# EAGLE board DragonBoard (EAGLE 6.6.0)
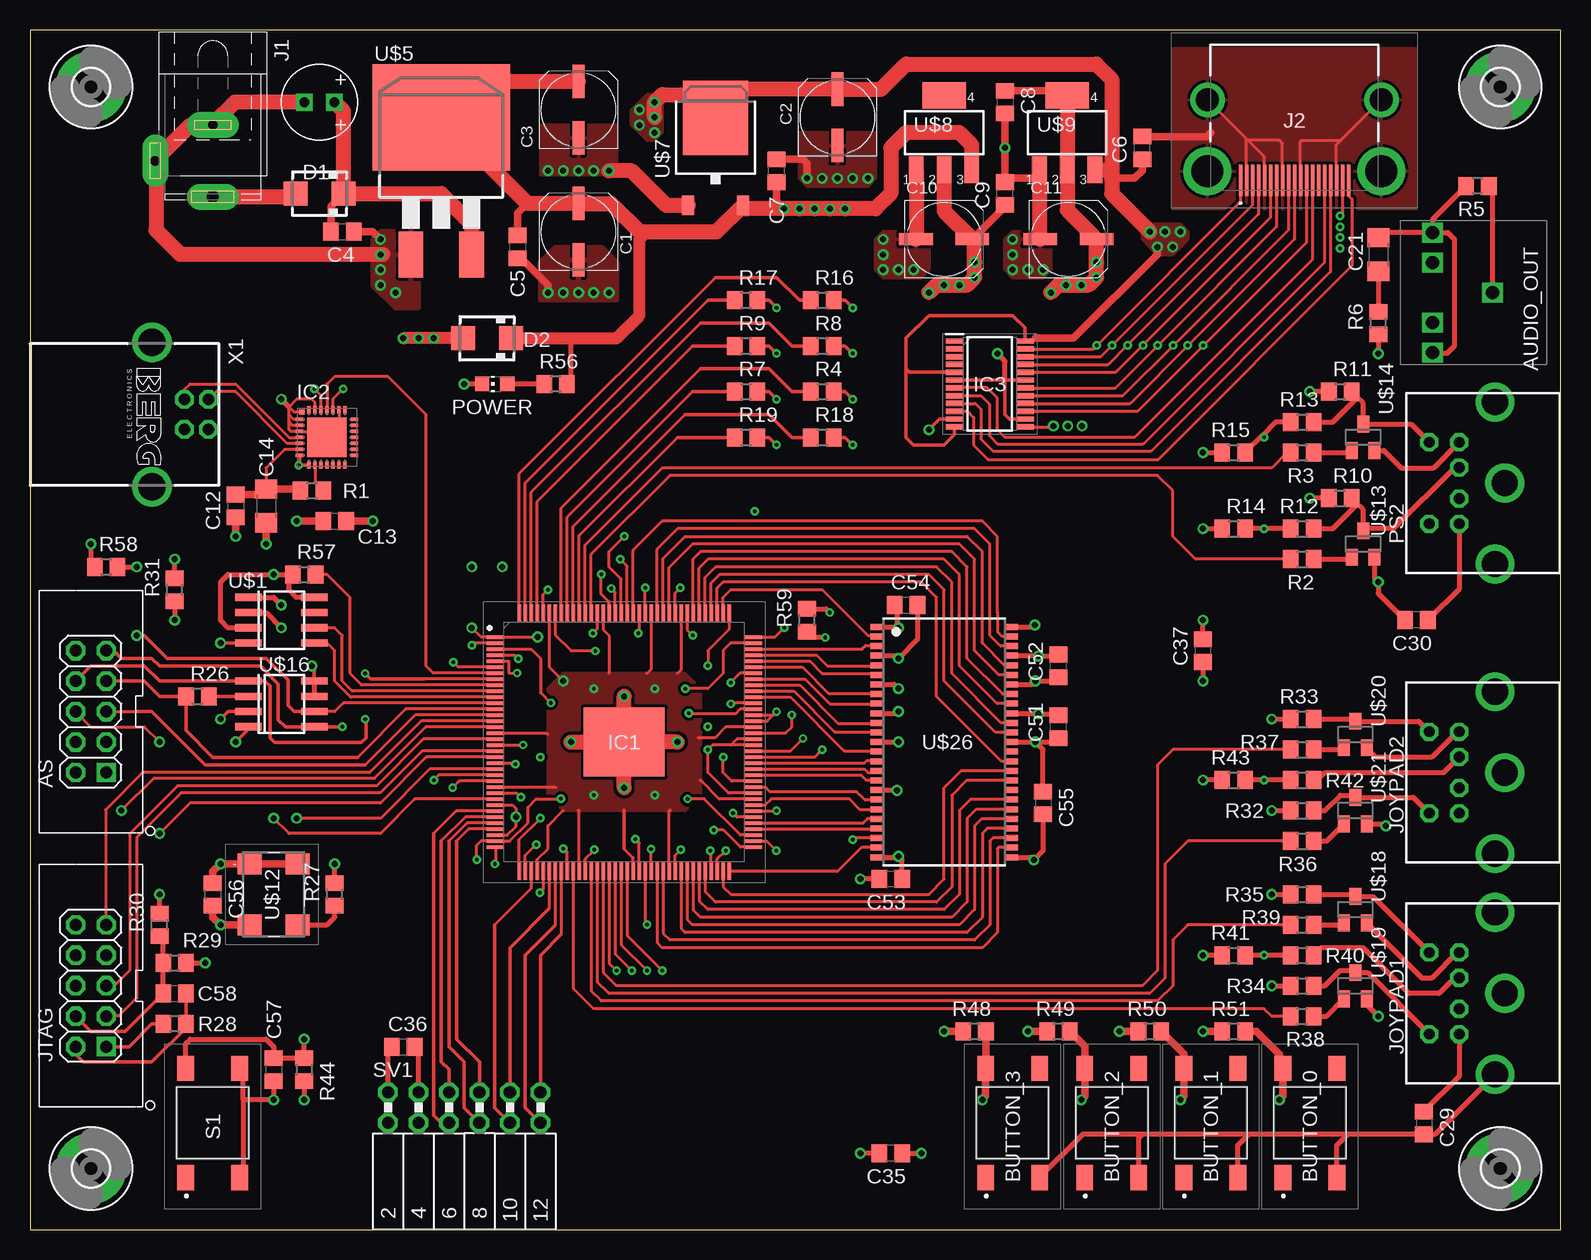
[diagram p2: board, top side]
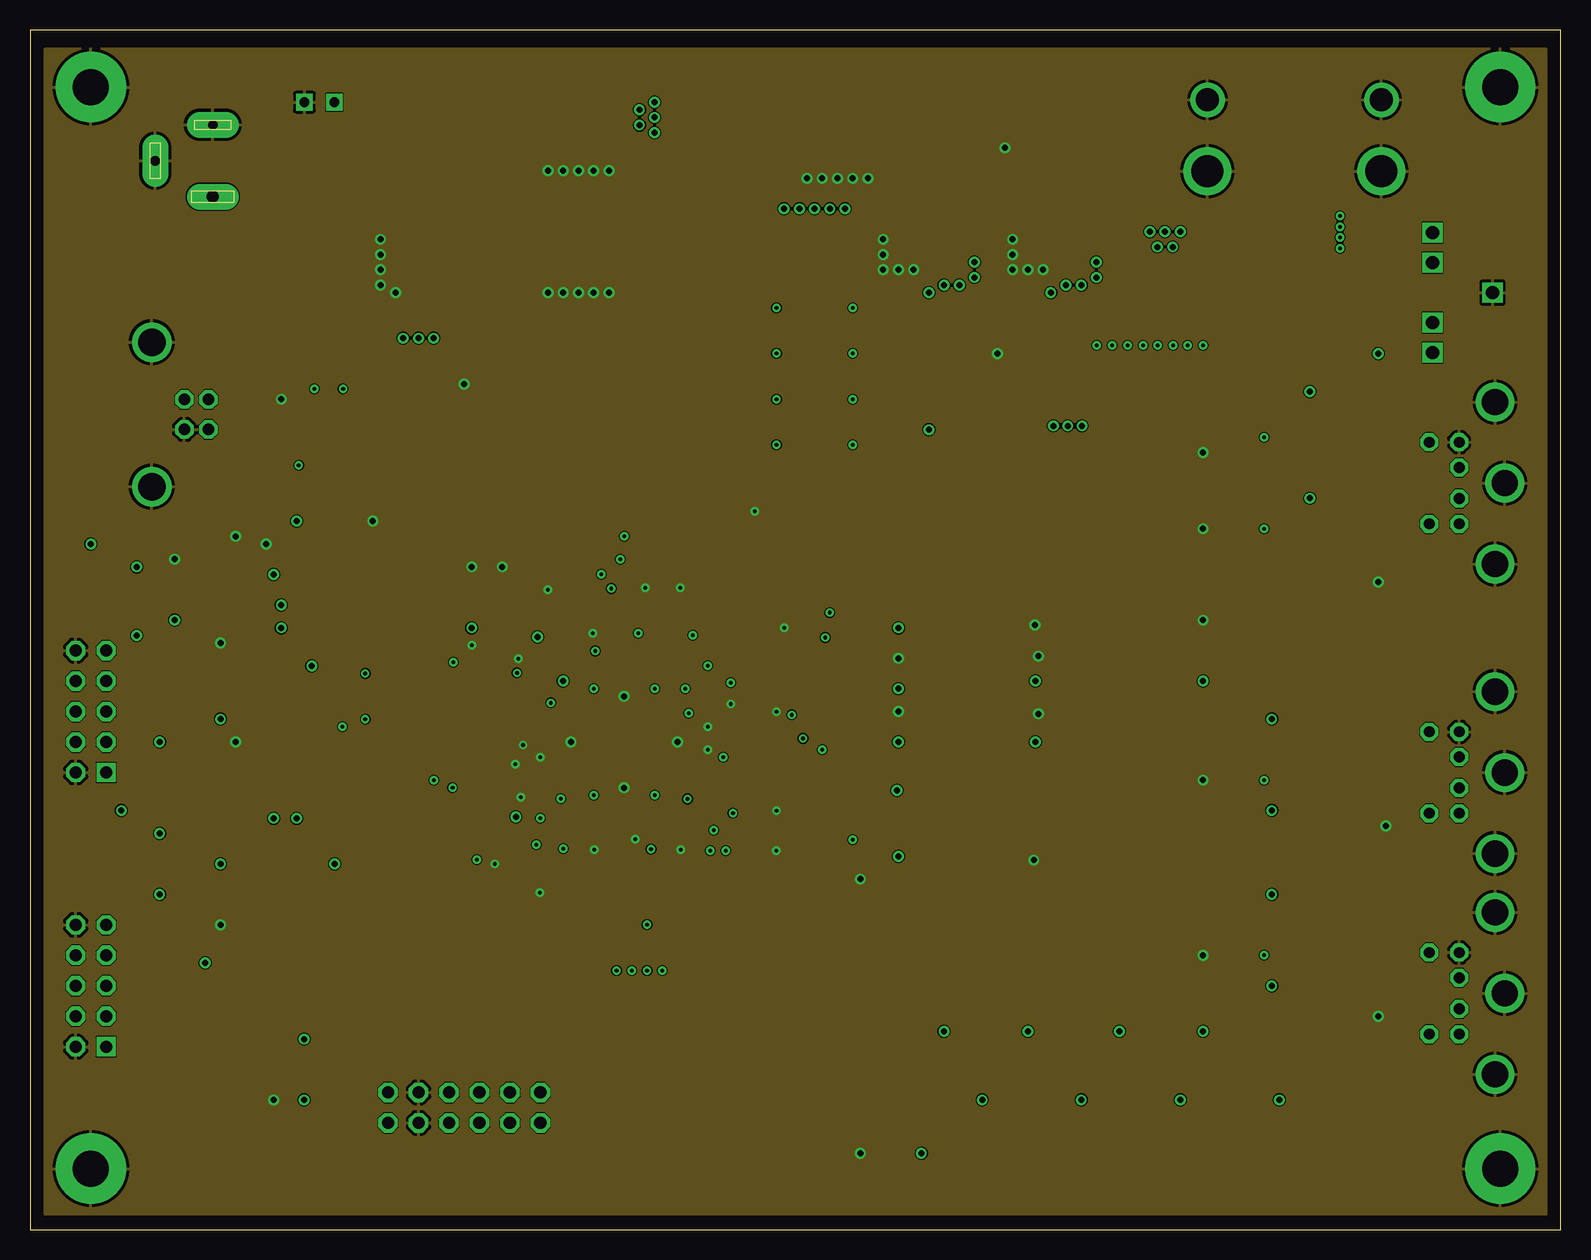
[diagram p3: board, inner layer Inner2]
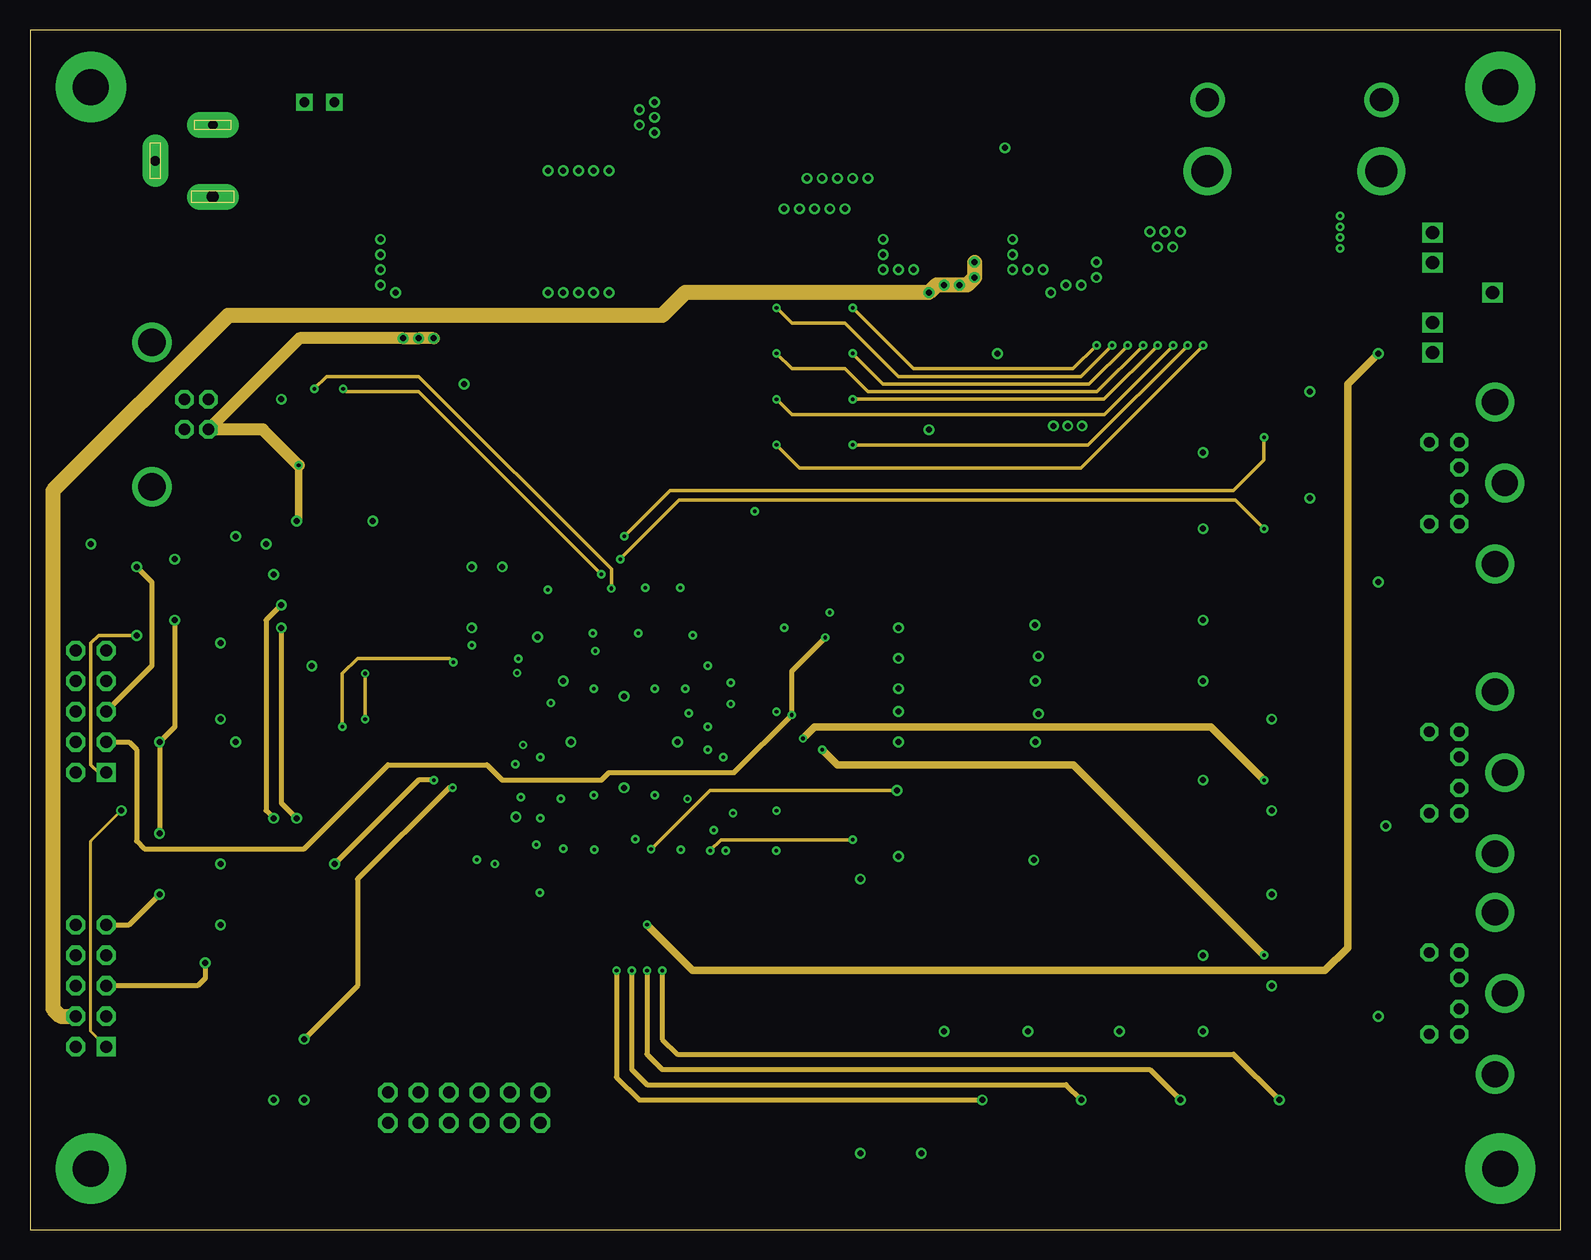
[diagram p4: board, inner layer Inner15]
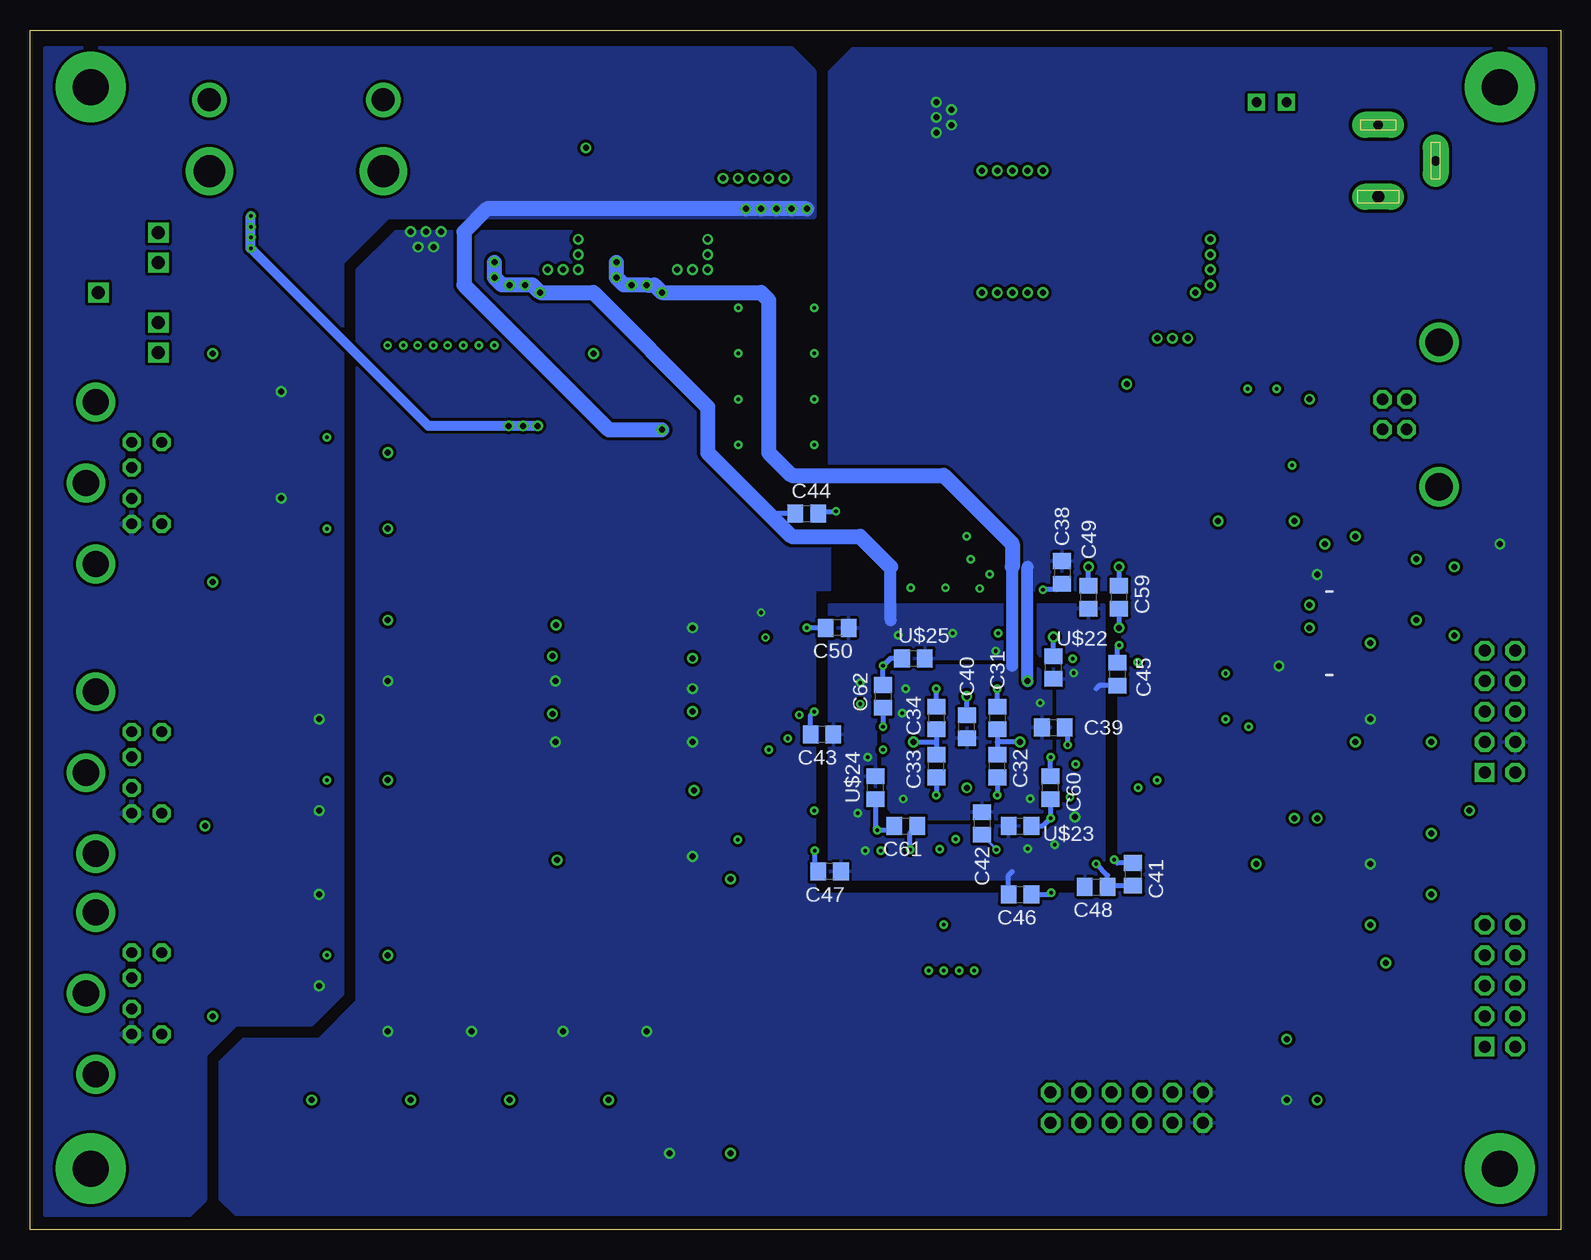
[diagram p5: board, bottom side, seen from below]

Size 127.61 x 100 mm. Coordinates in mm from the lower left corner, seen from the top.
Outline: 0,0 127.61,0 127.61,100 0,100 0,0
Copper layers (1*2+15*16): Top 0.035mm / dielectric 1.5mm / Inner2 0.035mm / dielectric 0.15mm / Inner15 0.035mm / dielectric 0.2mm / Bottom 0.035mm
Design rules "JLC_4_layer": minimum track width 0.09mm, minimum drill 0.2mm, track to track 0.09mm, track to pad 0.2mm, pad to pad 5mil, via to via 0.5mm, smd to smd 5mil, copper to edge 40mil, drill to drill 1mil, minimum pad ring 0.3mm, minimum via ring 0.2mm, stop-mask expansion 4mil, vias tented up to drill 0mil, thermal gap 10mil

## Footprints (pad centres in the part's own frame; a part is rotated, then mirrored left to right if it is on the bottom)
2X05 = drill 1.016 square: 1 -5.08,-1.27 | drill 1.016 octagon: 2 -5.08,1.27; 3 -2.54,-1.27; 4 -2.54,1.27; 5 0,-1.27; 6 0,1.27; 7 2.54,-1.27; 8 2.54,1.27; 9 5.08,-1.27; 10 5.08,1.27
3.5_AUDIO = drill 1.1 square: RING 5,-5; RING_SWITCH 2.5,-5; SLEEVE 0,0; TIP -5,-5; TIP_SWITCH -2.5,-5
LL3301NF065QG = smd 2.1 x 1.4: 1 -4.55,2.25; 2 4.55,2.25; 3 -4.55,-2.25; 4 4.55,-2.25
UD-6,3X5,8_NICHICON = smd 2.8 x 1: + 2.35,0; - -2.35,0
C0805 = smd 1.3 x 1.5: 1 -0.95,0; 2 0.95,0
C1206 = smd 1.6 x 1.8: 1 -1.4,0; 2 1.4,0
SMA = smd 2 x 2: A 2,0; C -2,0
3,0-PAD = drill 3 pad 5.842: B3,0 0,0
QFP50P2200X2200X165-145N = smd 1.475 x 0.3: 1 -10.738,8.75; 2 -10.738,8.25; 3 -10.738,7.75; 4 -10.738,7.25; 5 -10.738,6.75; 6 -10.738,6.25; 7 -10.738,5.75; 8 -10.738,5.25; 9 -10.738,4.75; 10 -10.738,4.25; 11 -10.738,3.75; 12 -10.738,3.25; 13 -10.738,2.75; 14 -10.738,2.25; 15 -10.738,1.75; 16 -10.738,1.25; 17 -10.738,0.75; 18 -10.738,0.25; 19 -10.738,-0.25; 20 -10.738,-0.75; 21 -10.738,-1.25; 22 -10.738,-1.75; 23 -10.738,-2.25; 24 -10.738,-2.75; 25 -10.738,-3.25; 26 -10.738,-3.75; 27 -10.738,-4.25; 28 -10.738,-4.75; 29 -10.738,-5.25; 30 -10.738,-5.75; 31 -10.738,-6.25; 32 -10.738,-6.75; 33 -10.738,-7.25; 34 -10.738,-7.75; 35 -10.738,-8.25; 36 -10.738,-8.75; 73 10.738,-8.75; 74 10.738,-8.25; 75 10.738,-7.75; 76 10.738,-7.25; 77 10.738,-6.75; 78 10.738,-6.25; 79 10.738,-5.75; 80 10.738,-5.25; 81 10.738,-4.75; 82 10.738,-4.25; 83 10.738,-3.75; 84 10.738,-3.25; 85 10.738,-2.75; 86 10.738,-2.25; 87 10.738,-1.75; 88 10.738,-1.25; 89 10.738,-0.75; 90 10.738,-0.25; 91 10.738,0.25; 92 10.738,0.75; 93 10.738,1.25; 94 10.738,1.75; 95 10.738,2.25; 96 10.738,2.75; 97 10.738,3.25; 98 10.738,3.75; 99 10.738,4.25; 100 10.738,4.75; 101 10.738,5.25; 102 10.738,5.75; 103 10.738,6.25; 104 10.738,6.75; 105 10.738,7.25; 106 10.738,7.75; 107 10.738,8.25; 108 10.738,8.75 | smd 0.3 x 1.475: 37 -8.75,-10.738; 38 -8.25,-10.738; 39 -7.75,-10.738; 40 -7.25,-10.738; 41 -6.75,-10.738; 42 -6.25,-10.738; 43 -5.75,-10.738; 44 -5.25,-10.738; 45 -4.75,-10.738; 46 -4.25,-10.738; 47 -3.75,-10.738; 48 -3.25,-10.738; 49 -2.75,-10.738; 50 -2.25,-10.738; 51 -1.75,-10.738; 52 -1.25,-10.738; 53 -0.75,-10.738; 54 -0.25,-10.738; 55 0.25,-10.738; 56 0.75,-10.738; 57 1.25,-10.738; 58 1.75,-10.738; 59 2.25,-10.738; 60 2.75,-10.738; 61 3.25,-10.738; 62 3.75,-10.738; 63 4.25,-10.738; 64 4.75,-10.738; 65 5.25,-10.738; 66 5.75,-10.738; 67 6.25,-10.738; 68 6.75,-10.738; 69 7.25,-10.738; 70 7.75,-10.738; 71 8.25,-10.738; 72 8.75,-10.738; 109 8.75,10.738; 110 8.25,10.738; 111 7.75,10.738; 112 7.25,10.738; 113 6.75,10.738; 114 6.25,10.738; 115 5.75,10.738; 116 5.25,10.738; 117 4.75,10.738; 118 4.25,10.738; 119 3.75,10.738; 120 3.25,10.738; 121 2.75,10.738; 122 2.25,10.738; 123 1.75,10.738; 124 1.25,10.738; 125 0.75,10.738; 126 0.25,10.738; 127 -0.25,10.738; 128 -0.75,10.738; 129 -1.25,10.738; 130 -1.75,10.738; 131 -2.25,10.738; 132 -2.75,10.738; 133 -3.25,10.738; 134 -3.75,10.738; 135 -4.25,10.738; 136 -4.75,10.738; 137 -5.25,10.738; 138 -5.75,10.738; 139 -6.25,10.738; 140 -6.75,10.738; 141 -7.25,10.738; 142 -7.75,10.738; 143 -8.25,10.738; 144 -8.75,10.738 | smd 6.76 x 5.765: 145 0,0
MLP28 = smd 0.6 x 0.3: 1 -2.3,1.5; 2 -2.3,1; 3 -2.3,0.5; 4 -2.3,0; 5 -2.3,-0.5; 6 -2.3,-1; 7 -2.3,-1.5; 15 2.3,-1.5; 16 2.3,-1; 17 2.3,-0.5; 18 2.3,0; 19 2.3,0.5; 20 2.3,1; 21 2.3,1.5 | smd 0.3 x 0.6: 8 -1.5,-2.3; 9 -1,-2.3; 10 -0.5,-2.3; 11 0,-2.3; 12 0.5,-2.3; 13 1,-2.3; 14 1.5,-2.3; 22 1.5,2.3; 23 1,2.3; 24 0.5,2.3; 25 0,2.3; 26 -0.5,2.3; 27 -1,2.3; 28 -1.5,2.3 | smd 3.3 x 3.3: EXP 0,0 | smd 0.435 x 0.435: M -2.103,2.103
SOP65P640X120-24N = smd 1.475 x 0.45: 1 -2.938,3.575; 2 -2.938,2.925; 3 -2.938,2.275; 4 -2.938,1.625; 5 -2.938,0.975; 6 -2.938,0.325; 7 -2.938,-0.325; 8 -2.938,-0.975; 9 -2.938,-1.625; 10 -2.938,-2.275; 11 -2.938,-2.925; 12 -2.938,-3.575; 13 2.938,-3.575; 14 2.938,-2.925; 15 2.938,-2.275; 16 2.938,-1.625; 17 2.938,-0.975; 18 2.938,-0.325; 19 2.938,0.325; 20 2.938,0.975; 21 2.938,1.625; 22 2.938,2.275; 23 2.938,2.925; 24 2.938,3.575
SPC4078 = drill 0.8 pad 2.184 long: 1 -3,0; 2 0,-4.8 | drill 1 pad 2.184 long: 3 3,0
RAHHD19TR = smd 0.28 x 2.6: 1 4.5,5.25; 2 4,5.25; 3 3.5,5.25; 4 3,5.25; 5 2.5,5.25; 6 2,5.25; 7 1.5,5.25; 8 1,5.25; 9 0.5,5.25; 10 0,5.25; 11 -0.5,5.25; 12 -1,5.25; 13 -1.5,5.25; 14 -2,5.25; 15 -2.5,5.25; 16 -3,5.25; 17 -3.5,5.25; 18 -4,5.25; 19 -4.5,5.25 | drill 2.66 pad 3.99: MH1 7.25,4.49; MH2 -7.25,4.49 | drill 1.92 pad 2.88: MH3 7.25,-1.47; MH4 -7.25,-1.47
MDIN06SS = drill 0.9 octagon: 1 1.3,8.5; 2 -1.3,8.5; 3 3.4,8.5; 4 -3.4,8.5; 5 3.4,11; 6 -3.4,11 | drill 2.2 pad 2.6: S1 -6.75,5.5; S2 0,4.7; S3 6.75,5.5
CHIP-LED0805 = smd 1.2 x 1.2: A 0,-1.05; C 0,1.05
R0805 = smd 1.3 x 1.5: 1 -0.95,0; 2 0.95,0
FE06-2W = drill 1.016 octagon: 1 -6.35,1.27; 2 -6.35,-1.27; 3 -3.81,1.27; 4 -3.81,-1.27; 5 -1.27,1.27; 6 -1.27,-1.27; 7 1.27,1.27; 8 1.27,-1.27; 9 3.81,1.27; 10 3.81,-1.27; 11 6.35,1.27; 12 6.35,-1.27
SO08 = smd 0.6 x 2.2: 1 -1.905,-2.75; 2 -0.635,-2.75; 3 0.635,-2.75; 4 1.905,-2.75; 5 1.905,2.75; 6 0.635,2.75; 7 -0.635,2.75; 8 -1.905,2.75
D2PACK = smd 2.083 x 3.81: 1 -2.54,-8.89; 3 2.54,-8.89 | smd 11.43 x 8.89: 2 0,2.54
NXA_35V100_6.3X11 = drill 0.8 square: P$1 -1.25,0; P$2 1.25,0
TO252 = smd 1 x 1.6: 1 -2.28,-4.8; 3 2.28,-4.8 | smd 5.4 x 6.2: 2 0,2.5
SOT223 = smd 1.219 x 2.235: 1 -2.311,-3.099; 2 0,-3.099; 3 2.311,-3.099 | smd 3.6 x 2.2: 4 0,3.099
ASV32000MHZET = smd 1.78 x 2: 1 -2.54,-2; 2 2.54,-2; 3 2.54,2; 4 -2.54,2
SOT23 = smd 1 x 1.4: 1 -0.95,-1.1; 2 0.95,-1.1; 3 0,1.1
TSOP50-II = smd 0.5 x 1.1: 1 -9.6,-5.6; 2 -8.8,-5.6; 3 -8,-5.6; 4 -7.2,-5.6; 5 -6.4,-5.6; 6 -5.6,-5.6; 7 -4.8,-5.6; 8 -4,-5.6; 9 -3.2,-5.6; 10 -2.4,-5.6; 11 -1.6,-5.6; 12 -0.8,-5.6; 13 0,-5.6; 14 0.8,-5.6; 15 1.6,-5.6; 16 2.4,-5.6; 17 3.2,-5.6; 18 4,-5.6; 19 4.8,-5.6; 20 5.6,-5.6; 21 6.4,-5.6; 22 7.2,-5.6; 23 8,-5.6; 24 8.8,-5.6; 25 9.6,-5.6; 26 9.6,5.6; 27 8.8,5.6; 28 8,5.6; 29 7.2,5.6; 30 6.4,5.6; 31 5.6,5.6; 32 4.8,5.6; 33 4,5.6; 34 3.2,5.6; 35 2.4,5.6; 36 1.6,5.6; 37 0.8,5.6; 38 0,5.6; 39 -0.8,5.6; 40 -1.6,5.6; 41 -2.4,5.6; 42 -3.2,5.6; 43 -4,5.6; 44 -4.8,5.6; 45 -5.6,5.6; 46 -6.4,5.6; 47 -7.2,5.6; 48 -8,5.6; 49 -8.8,5.6; 50 -9.6,5.6
PN61729-S = drill 0.95 octagon: 1 1.25,4.71; 2 -1.25,4.71; 3 -1.25,2.71; 4 1.25,2.71 | drill 2.3 pad 2.9: S1 -6.02,0; S2 6.02,0

## Placement (x,y rotation side)
AS  [2X05]  5.08,43.18 90 top
AUDIO_OUT  3.5_AUDIO  [3.5_AUDIO]  121.92,78.11 270 top
BUTTON_0  LL3301NF065QG  [LL3301NF065QG]  106.68,8.89 90 top
BUTTON_1  LL3301NF065QG  [LL3301NF065QG]  98.42,8.89 90 top
BUTTON_2  LL3301NF065QG  [LL3301NF065QG]  90.17,8.89 90 top
BUTTON_3  LL3301NF065QG  [LL3301NF065QG]  81.92,8.89 90 top
C1  100u  [UD-6,3X5,8_NICHICON]  45.72,83.19 90 top
C2  100u  [UD-6,3X5,8_NICHICON]  67.31,92.71 90 top
C3  100u  [UD-6,3X5,8_NICHICON]  45.72,93.34 90 top
C4  104  [C0805]  26.04,83.19 0 top
C5  104  [C0805]  40.64,81.92 270 top
C6  104  [C0805]  92.71,90.17 90 top
C7  104  [C0805]  62.23,88.27 90 top
C8  104  [C0805]  81.28,93.98 270 top
C9  104  [C0805]  81.28,86.36 90 top
C10  100u  [UD-6,3X5,8_NICHICON]  76.2,82.55 0 top
C11  100u  [UD-6,3X5,8_NICHICON]  86.56,82.55 0 top
C12  104  [C0805]  17.14,60.33 270 top
C13  104  [C0805]  25.4,59.05 0 top
C14  106  [C1206]  19.68,60.33 270 top
C21  106  [C1206]  112.39,81.28 270 top
C29  104  [C0805]  116.2,8.89 270 top
C30  104  [C0805]  115.57,50.8 180 top
C31  104  [C0805]  46.99,42.65 270 bottom
C32  104  [C0805]  46.99,38.63 90 bottom
C33  104  [C0805]  52.07,38.63 90 bottom
C34  104  [C0805]  52.07,42.65 270 bottom
C35  104  [C0805]  71.75,6.35 180 top
C36  104  [C0805]  31.11,15.24 0 top
C37  104  [C0805]  97.79,48.26 90 top
C38  104  [C0805]  41.58,54.78 270 bottom
C39  104  [C0805]  42.31,41.87 0 bottom
C40  104  [C0805]  49.53,41.91 90 bottom
C41  104  [C0805]  35.67,29.61 270 bottom
C42  104  [C0805]  48.26,33.85 270 bottom
C43  104  [C0805]  61.59,41.27 180 bottom
C44  104  [C0805]  62.87,59.69 0 bottom
C45  104  [C0805]  36.95,46.29 90 bottom
C46  104  [C0805]  45.09,27.94 0 bottom
C47  104  [C0805]  60.96,29.84 180 bottom
C48  104  [C0805]  38.73,28.57 0 bottom
C49  104  [C0805]  39.37,52.7 90 bottom
C50  104  [C0805]  60.33,50.16 180 bottom
C51  104  [C0805]  85.72,41.91 90 top
C52  104  [C0805]  85.72,46.99 90 top
C53  104  [C0805]  71.75,29.21 180 top
C54  104  [C0805]  73.03,52.07 0 top
C55  104  [C0805]  84.45,35.56 270 top
C56  104  [C0805]  15.24,27.94 270 top
C57  104  [C0805]  20.32,13.34 270 top
C58  104  [C0805]  12.06,19.68 0 top
C59  104  [C0805]  36.83,52.7 90 bottom
C60  104  [C0805]  42.55,36.83 90 bottom
C61  104  [C0805]  54.61,33.66 0 bottom
C62  104  [C0805]  56.52,44.45 270 bottom
D1  MBRA340T3  [SMA]  24.13,86.36 180 top
D2  MBRA340T3  [SMA]  38.1,74.3 180 top
H1  MOUNT-PAD-ROUND3.0  [3,0-PAD]  5.08,95.25 0 top
H2  MOUNT-PAD-ROUND3.0  [3,0-PAD]  122.56,95.25 0 top
H3  MOUNT-PAD-ROUND3.0  [3,0-PAD]  122.56,5.08 0 top
H4  MOUNT-PAD-ROUND3.0  [3,0-PAD]  5.08,5.08 0 top
IC1  EP4CE15E22C8N  [QFP50P2200X2200X165-145N]  49.53,40.64 0 top
IC2  CP2102  [MLP28]  24.77,66.04 0 top
IC3  TPD12S016PWR  [SOP65P640X120-24N]  80.01,70.48 0 top
J1  [SPC4078]  15.24,89.1 270 top
J2  RAHHD19TR  [RAHHD19TR]  105.41,92.71 180 top
JOYPAD1  [MDIN06SS]  127.64,19.68 90 top
JOYPAD2  [MDIN06SS]  127.64,38.1 90 top
JTAG  [2X05]  5.08,20.32 90 top
POWER  LED_0805  [CHIP-LED0805]  38.73,70.48 90 top
PS2  [MDIN06SS]  127.64,62.23 90 top
R1  10k  [R0805]  23.5,61.59 0 top
R2  5k6  [R0805]  106.05,55.88 0 top
R3  5k6  [R0805]  106.05,64.77 0 top
R4  50  [R0805]  66.04,69.85 0 top
R5  5k6  [R0805]  120.65,87 180 top
R6  10k  [R0805]  112.39,75.56 90 top
R7  50  [R0805]  59.69,69.85 0 top
R8  50  [R0805]  66.04,73.66 0 top
R9  50  [R0805]  59.69,73.66 0 top
R10  1k  [R0805]  109.22,60.96 0 top
R11  1k  [R0805]  109.22,69.85 0 top
R12  5k6  [R0805]  106.05,58.42 0 top
R13  5k6  [R0805]  106.05,67.31 0 top
R14  10k  [R0805]  100.33,58.42 0 top
R15  10k  [R0805]  100.33,64.77 0 top
R16  50  [R0805]  66.04,77.47 0 top
R17  50  [R0805]  59.69,77.47 0 top
R18  50  [R0805]  66.04,66.04 0 top
R19  50  [R0805]  59.69,66.04 0 top
R26  33  [R0805]  13.97,44.45 0 top
R27  33  [R0805]  25.4,27.94 90 top
R28  1k  [R0805]  12.06,17.14 180 top
R29  10k  [R0805]  12.06,22.23 0 top
R30  10k  [R0805]  10.79,25.4 90 top
R31  10k  [R0805]  12.06,53.34 90 top
R32  1k  [R0805]  106.05,34.92 0 top
R33  1k  [R0805]  106.05,42.55 0 top
R34  1k  [R0805]  106.05,20.32 0 top
R35  1k  [R0805]  106.05,27.94 0 top
R36  5k6  [R0805]  106.05,32.38 0 top
R37  5k6  [R0805]  106.05,40.01 0 top
R38  5k6  [R0805]  106.05,17.78 0 top
R39  5k6  [R0805]  106.05,25.4 0 top
R40  5k6  [R0805]  106.05,22.86 0 top
R41  10k  [R0805]  100.33,22.86 0 top
R42  5k6  [R0805]  106.05,37.47 0 top
R43  10k  [R0805]  100.33,37.47 0 top
R44  10k  [R0805]  22.86,13.34 270 top
R48  10k  [R0805]  78.74,16.51 180 top
R49  10k  [R0805]  85.72,16.51 180 top
R50  10k  [R0805]  93.34,16.51 180 top
R51  10k  [R0805]  100.33,16.51 180 top
R56  2k2  [R0805]  43.81,70.48 180 top
R57  10k  [R0805]  22.86,54.61 0 top
R58  10k  [R0805]  6.35,55.24 0 top
R59  10k  [R0805]  64.77,50.8 90 top
S1  LL3301NF065QG  [LL3301NF065QG]  15.24,8.89 90 top
SV1  [FE06-2W]  36.2,10.16 0 top
U$1  BY25Q16BS  [SO08]  20.95,50.8 270 top
U$5  LM1086  [D2PACK]  34.29,90.17 0 top
U$6  NXA_35V100_6.3X11  [NXA_35V100_6.3X11]  24.13,93.98 0 top
U$7  LD1117D-3.3  [TO252]  57.15,90.17 0 top
U$8  KIA1117-2.5  [SOT223]  76.2,91.44 0 top
U$9  AZ1117H-1.2TRG1  [SOT223]  86.46,91.44 0 top
U$12  OT705050MJBA4SL  [ASV32000MHZET]  20.32,27.94 270 top
U$13  PMBT3904  [SOT23]  111.12,57.15 0 top
U$14  PMBT3904  [SOT23]  111.12,66.04 0 top
U$16  BY25Q16BS  [SO08]  20.95,43.81 270 top
U$18  PMBT3904  [SOT23]  110.49,26.67 0 top
U$19  PMBT3904  [SOT23]  110.49,20.32 0 top
U$20  PMBT3904  [SOT23]  110.49,41.27 0 top
U$21  PMBT3904  [SOT23]  110.49,34.92 0 top
U$22  CBG201209U601T  [C0805]  42.31,46.85 90 bottom
U$23  CBG201209U601T  [C0805]  45.09,33.66 0 bottom
U$24  CBG201209U601T  [C0805]  57.15,36.83 90 bottom
U$25  CBG201209U601T  [C0805]  53.98,47.62 0 bottom
U$26  W9816G6JH  [TSOP50-II]  76.2,40.64 270 top
X1  PN61729-S  [PN61729-S]  10.16,67.94 270 top

## Tracks (layer width: path | path; a pad name or v marks a point on that pad's centre or on a via)
1V2  (via drill 0.3, 0.5)
  Top 0.254: IC1.124 50.78,49.78 v50.7,49.7 | IC1.5 39.9,47.39 39.9,46.4 v40.6,46.4 | IC1.38 41.28,31.18 v42.2,32.1 | IC1.29 40.21,35.39 40.5,35.1 v40.5,34.4 40.5,33.6 39.79,32.89 IC1.34 | IC1.45 44.78,31.42 | IC1.116 54.78,49.99 v55.24,49.53 | IC1.138 43.78,49.56 45.09,48.26 47.08,48.26 v47.11,48.23 | IC1.70 57.28,30.88 v58,31.6 | IC1.102 59.19,46.39 v58.4,45.6 | IC1.84 58.49,37.39 57.78,38.1 v57.78,39.37 | IC1.78 58.91,34.39 v58.6,34.7
  Top 0.305: 44.78,31.42 v44.45,31.75
  Top 0.61: C8.1 86.07,94.93 U$9.4
  Top 1.27: U$9.4 U$9.2 86.46,85 C11.+ v88.9,80.64 v88.9,79.38 88.27,78.74 v87.63,78.74 v86.36,78.74 85.72,78.74 v85.09,78.11
  Bottom 0.406: C46.1 46.03,29.53 45.72,29.84 | C45.1 38.48,45.34 38.73,45.09 | C44.1 65.41,59.69 65.72,59.37
  Bottom 1.016: 55.88,50.8 55.88,55.24
  Bottom 1.27: v88.9,80.64 v88.9,79.38 88.27,78.74 v87.63,78.74 v86.36,78.74 85.72,78.74 v85.09,78.11 80.64,78.11 71.12,68.58 71.12,64.77 65.72,59.37 64.14,57.78 58.42,57.78 55.88,55.24
  pour Bottom (isolate 0.254): 47.62,52.07 46.35,52.07 46.35,47.62 55.88,47.62 57.15,46.35 57.15,34.92 55.88,33.66 43.18,33.66 41.91,34.92 41.91,46.35 43.18,47.62 43.81,48.26 43.81,52.07 38.1,52.07 38.1,29.21 60.96,29.21 60.96,52.07
2V5  (via drill 0.3, 0.5)
  Top 0.254: IC1.3 41.78,48.39 42.55,47.62 42.55,44.76 v43.4,43.9 | v44.23,35.9 42.2,35.9 41.5,35.2 41.5,33.9 39.99,32.39 IC1.35 37.59,32.39 37.2,32 37.2,30.87 v37.25,30.82 | IC1.107 58.41,48.89 57.78,48.26 57.78,46.35 56.52,45.09 v54.61,45.09 | IC1.96 59.19,43.39 58.8,43 54.95,43 v54.91,43.05 | IC1.75 59.21,32.89 56.2,35.9 v54.81,35.9
  Top 0.305: JTAG.4 5.08,16.51 7.94,16.51 C58.1
  Top 0.406: C58.1 R29.1 11.12,24.13 R30.1
  Top 0.61: C9.1 81.28,85.28 C10.+
  Top 1.27: U$8.2 76.2,84.9 C10.+ 78.74,82.36 v78.74,80.64 v78.74,79.38 78.11,78.74 v77.47,78.74 v76.2,78.74 75.56,78.74 v74.93,78.11
  Inner15 1.27: v78.74,80.64 v78.74,79.38 78.11,78.74 v77.47,78.74 v76.2,78.74 75.56,78.74 v74.93,78.11 54.61,78.11 52.7,76.2 16.51,76.2 1.91,61.59 1.91,18.41 2.54,17.78 JTAG.4
  Bottom 0.406: C41.1 36.99,30.56 v37.25,30.82
  Bottom 1.016: 45.72,46.99 45.72,55.24
  Bottom 1.27: v78.74,80.64 v78.74,79.38 78.11,78.74 v77.47,78.74 v76.2,78.74 75.56,78.74 v74.93,78.11 66.67,78.11 66.04,77.47 66.04,64.77 64.14,62.87 51.44,62.87 45.72,57.15 45.72,55.24
  pour Bottom (isolate 0.254): 42.55,41.91 42.55,35.56 43.81,34.29 55.24,34.29 56.52,35.56 56.52,45.72 55.24,46.99 44.45,46.99 43.81,46.99 42.55,45.72
3V3  (via drill 0.3, 0.5)
  Top 0.254: IC1.17 43.06,41.39 43.18,41.27 | IC1.139 43.28,46.89 v44.45,45.72 | IC1.117 54.28,46.66 53.98,46.35 | IC1.26 43.76,36.89 43.81,36.83 | IC1.40 42.28,30.85 43.18,31.75 43.18,33.66 44.45,34.92 | IC1.47 45.78,34.87 | IC1.62 53.28,34.87 | IC1.56 50.28,31 49.53,31.75 | IC1.122 51.78,46.7 51.44,46.35 | IC1.130 47.78,50.01 48.26,49.53 48.26,46.35 | IC1.81 57.45,35.89 55.88,37.47 | IC1.93 57.99,41.89 57.1,41 55.7,41
  Top 0.305: IC3.12 77.07,66.28 76.2,65.41 73.66,65.41 73.03,66.04 73.03,71.75 | 73.03,71.75 73.03,74.3 74.93,76.2 81.92,76.2 82.95,75.17 IC3.24 83.58,74.06 83.82,74.3 | IC3.5 73.32,71.46 73.03,71.75 | U$16.3 16.51,43.18 v15.88,42.55 | U$16.8 23.7,46.78 v23.5,46.99 | 45.78,34.87 45.72,34.92 | 53.28,34.87 53.34,34.92 | 49.53,31.75 49.53,34.92
  Top 0.406: U$26.1 72.31,50.24 | 72.31,50.24 v72.39,50.16 | U$26.7 72.03,45.44 v72.39,45.09 | U$26.13 v72.39,40.64 | U$26.25 72.31,31.04 v72.39,31.11 72.7,30.8 C53.1 | U$26.44 83.54,45.44 v83.82,45.72 85.41,45.72 C52.1 | U$26.38 v83.82,40.64 | v83.82,40.64 85.41,40.64 C51.1 | 72.31,50.24 72.31,51.83 C54.1 | C55.1 84.45,40.01 v83.82,40.64 | U$16.8 U$16.7 | U$1.3 16.51,50.16 15.88,50.8 15.88,53.98 16.51,54.61 v20.32,54.61 R57.1 21.59,54.29 21.59,53.34 22.23,52.7 U$1.8 | R44.2 v22.86,10.79 | R59.2 66.36,51.75 v66.67,51.44 | v5.08,57.15 5.08,55.56 R58.1 | C35.1 v74.3,6.35 | C37.1 v97.79,45.72 | SV1.1 29.84,14.92 C36.1
  Top 0.61: 83.82,74.3 87,74.3 93.98,81.28 v93.98,81.92 | v76.2,16.51 R48.2 | v83.19,16.51 R49.2 | v90.81,16.51 R50.2 | v97.79,16.51 R51.2 | C6.1 92.71,88.27 92.08,87.63 90.17,87.63 | C56.1 15.24,29.84 v15.88,30.48 U$12.1 U$12.4
  Top 1.27: 90.17,88.27 90.17,95.89 88.9,97.16 73.03,97.16 70.93,95.06 C2.+ 59.54,95.06 U$7.2 55.2,94.61 52.7,94.61 v52.07,93.98 v52.07,92.71 | 90.17,88.27 90.17,87.63 90.17,86.36 v93.34,83.19 | U$9.3 90.09,88.34 90.17,88.27
  Bottom 0.406: C32.1 v46.99,36.2 | C33.1 v52.07,36.2 | C34.1 v52.07,45.09 | C31.1 v46.99,45.09
  Bottom 1.016: v44.45,45.72 44.45,55.24
  other vias: 94.61,83.19 95.89,83.19 95.25,81.92 52.07,91.44 50.8,93.34 50.8,92.08
  pour Top (isolate 0.254): 43.18,36.2 43.18,45.09 44.45,46.35 54.61,46.35 55.88,45.09 55.88,36.2 54.61,34.92 44.45,34.92
  pour Top (isolate 0.254): 94.61,83.82 95.89,83.82 96.52,83.19 96.52,82.55 95.89,81.92 95.25,81.28 93.98,81.28 93.34,81.92 92.71,82.55 92.71,83.19 93.34,83.82
  pour Top (isolate 0.254): 52.7,92.71 52.7,93.98 52.07,94.61 51.44,94.61 50.8,93.98 50.16,93.34 50.16,92.08 50.8,91.44 51.44,90.81 52.07,90.81 52.7,91.44
  pour Bottom (isolate 0.254): 60.96,88.9 60.96,96.52 59.05,98.42 1.27,98.42 1.27,1.27 51.44,1.27 51.44,27.94 36.83,27.94 36.83,53.34 60.96,53.34
  pour Bottom (isolate 0.254): 100.33,80.01 100.33,19.05 103.5,15.88 109.86,15.88 111.76,13.97 111.76,2.54 110.49,1.27 51.44,1.27 51.44,27.94 62.23,27.94 62.23,53.34 60.96,53.34 60.96,83.19 97.16,83.19
5V0  (via drill 0.5)
  Top 0.305: IC3.11 75.81,67.56 v74.93,66.67
  Top 0.406: R11.1 v106.68,69.85 | R10.1 v106.68,60.96 | v103.5,27.94 R35.1 | v103.5,20.32 R34.1 | v103.5,34.92 R32.1 | v103.5,42.55 R33.1 | PS2.4 119.14,53.41 C30.1 | JOYPAD1.4 119.14,12.77 C29.1 | R56.1 45.09,70.48 45.09,74.3
  Top 0.61: C5.1 40.64,84.71 41.47,85.53 | C7.1 62.23,85.72 v62.87,85.09
  Top 1.016: D2.C 45.09,74.3 48.9,74.3 50.8,76.2 50.8,82.55 51.44,83.19
  Top 1.27: C3.+ 37.27,95.69 U$5.2 41.47,85.53 C1.+ 48.45,85.53 50.8,83.19 51.44,83.19 57.24,83.19 U$7.3 59.71,85.09 v62.87,85.09 v64.14,85.09 v65.41,85.09 v66.67,85.09 v67.94,85.09 70.48,85.09 71.75,86.36 71.75,90.17 73.03,91.44 77.47,91.44 78.51,90.4 U$8.3
  Bottom 1.27: v62.87,85.09 v62.88,85.1 64.12,85.1 v64.14,85.09 v65.41,85.09 v66.67,85.09 v67.94,85.09 89.53,85.09 91.44,83.19 91.44,78.74 79.38,66.67 v74.93,66.67
  pour Bottom (isolate 0.254): 62.23,84.45 62.23,96.52 64.14,98.42 126.36,98.42 126.36,1.27 114.3,1.27 113.03,2.54 113.03,14.61 110.49,17.14 104.14,17.14 101.6,19.68 101.6,80.64 97.79,84.45
A0
  Top 0.254: IC1.77 69.45,33.89 69.85,34.29 70.55,34.29 U$26.21
A1
  Top 0.254: IC1.76 70.55,33.39 U$26.22
A2  (via drill 0.3)
  Top 0.254: IC1.69 56.78,31.52 v56.7,31.6 | U$26.23 68.74,32.64 v68.6,32.5
  Inner15 0.305: v68.6,32.5 57.6,32.5 v56.7,31.6
A3
  Top 0.254: U$26.24 69.31,31.84 67.31,29.84 58.34,29.84 IC1.72
A4
  Top 0.254: U$26.27 80.73,31.84 80.64,31.75 80.64,24.77 79.38,23.5 52.7,23.5 52.28,23.92 IC1.60
A5
  Top 0.254: U$26.28 80.27,32.64 80.01,32.38 80.01,25.4 78.74,24.13 53.34,24.13 52.78,24.69 IC1.61
A6
  Top 0.254: U$26.29 79.8,33.44 79.38,33.02 79.38,26.04 78.11,24.77 54.61,24.77 54.28,25.09 IC1.64
A7
  Top 0.254: U$26.30 79.33,34.24 78.74,33.66 78.74,26.67 77.47,25.4 55.24,25.4 54.78,25.86 IC1.65
A8
  Top 0.254: U$26.31 78.86,35.04 78.11,34.29 78.11,27.3 76.83,26.04 55.88,26.04 55.28,26.64 IC1.66
A9
  Top 0.254: U$26.32 78.39,35.84 77.47,34.92 77.47,27.94 76.2,26.67 56.52,26.67 55.78,27.41 IC1.67
A10
  Top 0.254: U$26.20 70.48,34.92 70.47,34.92 70.4,35 69.2,35 68.3,35.9 61.8,35.9 61.29,35.39 IC1.80
ASDO  (via drill 0.3)
  Top 0.254: IC1.6 35.7,46.89 v35.3,47.3
  Top 0.305: v26.04,41.91 U$16.5 21.3,41.9 20.7,42.5 20.7,45.5 19.21,46.99 10.79,46.99 10.16,47.62 7.62,47.62 6.99,48.26 AS.9
  Inner15 0.305: v35.3,47.3 34.97,47.62 27.3,47.62 26.04,46.35 v26.04,41.91
AUDIO  (via drill 0.3, 0.5)
  Top 0.254: IC1.58 51.28,25.55 v51.44,25.4
  Top 0.406: R6.1 v112.39,73.03
  Inner15 0.61: v112.39,73.03 109.86,70.48 109.86,23.5 107.95,21.59 55.24,21.59 v51.44,25.4
BS
  Top 0.254: IC1.83 61.3,36.89 61.69,36.5 68.9,36.5 69.2,36.2 69.22,36.2 69.61,35.8 70.56,35.8 U$26.19
BUTTON_0  (via drill 0.3, 0.5)
  Top 0.254: IC1.55 49.78,24.52 v52.7,21.59
  Top 0.61: R51.1 102.23,16.51 104.14,14.61 104.14,13.73 BUTTON_0.2 104.43,11.09 v104.14,10.79
  Inner15 0.406: v52.7,21.59 52.7,15.88 53.98,14.61 100.33,14.61 v104.14,10.79
BUTTON_1  (via drill 0.3, 0.5)
  Top 0.254: IC1.54 49.28,23.75 v51.44,21.59
  Top 0.61: R50.1 96.17,14.63 BUTTON_1.2 96.17,11.09 v95.89,10.79
  Inner15 0.406: v51.44,21.59 51.44,14.61 52.7,13.34 93.34,13.34 v95.89,10.79
BUTTON_2  (via drill 0.3, 0.5)
  Top 0.254: IC1.53 48.78,22.98 v50.16,21.59
  Top 0.61: R49.1 87.92,15.27 BUTTON_2.2 87.92,11.09 v87.63,10.79
  Inner15 0.406: v50.16,21.59 50.16,13.34 51.44,12.06 86.36,12.06 v87.63,10.79
BUTTON_3  (via drill 0.3, 0.5)
  Top 0.254: IC1.52 48.28,22.2 v48.9,21.59
  Top 0.61: R48.1 79.69,13.46 BUTTON_3.2 79.67,11.09 v79.38,10.79
  Inner15 0.406: v48.9,21.59 48.9,12.7 50.8,10.79 v79.38,10.79
BY_MISO  (via drill 0.5)
  Top 0.254: IC1.23 33.31,38.39 29.21,34.29 v22.23,34.29
  Top 0.406: U$1.2 19.68,51.44 v20.95,50.16
  Inner15 0.406: v20.95,50.16 20.95,35.56 v22.23,34.29
BY_MOSI
  Top 0.254: IC1.11 26.73,44.39 25.4,45.72 25.4,48.26 24.77,48.9 U$1.5
BY_NCS  (via drill 0.5)
  Top 0.254: IC1.28 32.08,35.89 29.21,33.02 21.59,33.02 v20.32,34.29
  Top 0.406: U$1.1 20.32,52.7 v20.95,52.07
  Inner15 0.406: v20.95,52.07 19.68,50.8 19.68,34.92 v20.32,34.29
BY_SCLK
  Top 0.254: IC1.10 26.86,44.89 26.04,45.72 26.04,49.53 25.4,50.16 U$1.6
CEC_B
  Top 0.254: J2.13 106.91,80.88 92.08,66.04 81.28,66.04 80.64,66.67 80.64,69.32 79.77,70.2 77.11,70.2 IC3.7
CKE
  Top 0.254: U$26.34 78.08,37.44 76.83,36.2 76.83,28.57 75.56,27.3 57.15,27.3 56.28,28.18 IC1.68
CONFIG_DONE  (via drill 0.3)
  Top 0.254: IC1.92 62.98,41.39 63.5,41.91 v63.5,42.9
  Top 0.406: v66.3,49.35 65.27,49.35 R59.1
  Inner15 0.406: v66.3,49.35 63.5,46.55 v63.5,42.9 58.7,38.1 48.26,38.1 47.62,37.47 39.37,37.47 38.1,38.73 29.84,38.73 22.86,31.75 9.53,31.75 8.89,32.38 8.89,40.01 8.26,40.64 AS.3
CP2102_RTS  (via drill 0.3)
  Top 0.254: IC1.129 48.28,52.32 47.6,53 47.6,54.59 v47.62,54.61 | IC2.24 25.27,69.27 v26.1,70.1
  Inner15 0.305: v47.62,54.61 32.38,69.85 26.35,69.85 v26.1,70.1
CP2102_RXD
  Top 0.254: IC2.25 24.77,70.48 25.4,71.12 29.84,71.12 33.02,67.94 33.02,46.99 33.62,46.39 IC1.7
CP2102_TXD  (via drill 0.3)
  Top 0.254: IC1.128 48.78,53.12 v48.46,53.44 | IC2.26 24.27,69.53 v23.7,70.1
  Inner15 0.305: v48.46,53.44 48.46,55.05 32.38,71.12 24.72,71.12 v23.7,70.1
DATA
  Top 0.254: IC1.13 31.32,43.39 27.3,39.37
  Top 0.305: AS.7 9.53,45.72 10.79,44.45 R26.1 13.02,41.59 15.24,39.37 27.3,39.37
DCLK  (via drill 0.5)
  Top 0.254: IC1.12 26.11,43.89 25.4,43.18 U$16.6
  Top 0.305: U$16.6 22.02,43.18 21.5,43.7 21.5,45.81 19.68,47.62 11.43,47.62 9.53,49.53 v8.89,49.53
  Inner15 0.305: AS.1 5.71,38.1 5.08,38.73 5.08,48.9 5.71,49.53 v8.89,49.53
DQ0
  Top 0.254: IC1.110 57.78,52.7 58.42,53.34 66.04,53.34 69.85,49.53 70.51,49.53 U$26.2
DQ1
  Top 0.254: IC1.106 69.37,48.39 69.68,48.7 70.54,48.7 U$26.3
DQ2
  Top 0.254: 70.56,47 U$26.5 70.55,46.99 66.47,46.99 65.58,47.89 IC1.105
DQ3
  Top 0.254: 70.56,46.2 U$26.6 70.48,46.35 66.04,46.35 65,47.39 IC1.104
DQ4
  Top 0.254: 70.56,44.6 U$26.8 70.54,44.7 66.57,44.7 64.38,46.89 IC1.103
DQ5
  Top 0.254: 70.54,43.9 U$26.9 70.58,43.81 66.67,43.81 64.6,45.89 IC1.101
DQ6
  Top 0.254: 70.54,42.3 U$26.11 70.56,42.2 67.37,42.2 64.18,45.39 IC1.100
DQ7
  Top 0.254: 70.56,41.4 U$26.12 70.54,41.5 67.07,41.5 63.68,44.89 IC1.99
DQ8
  Top 0.254: U$26.39 80.48,41.44 76.2,45.72 76.2,53.34 74.93,54.61 57.48,54.61 56.78,53.91 IC1.112
DQ9
  Top 0.254: U$26.40 80.95,42.24 76.83,46.35 76.83,53.98 75.56,55.24 57.15,55.24 56.28,54.38 IC1.113
DQ10
  Top 0.254: U$26.42 80.62,43.84 77.47,46.99 77.47,54.61 76.2,55.88 56.52,55.88 55.78,55.15 IC1.114
DQ11
  Top 0.254: U$26.43 81.09,44.64 78.11,47.62 78.11,55.24 76.83,56.52 55.88,56.52 55.28,55.91 IC1.115
DQ12
  Top 0.254: U$26.45 80.76,46.24 78.74,48.26 78.74,55.88 77.47,57.15 55.24,57.15 53.28,55.19 IC1.119
DQ13
  Top 0.254: U$26.46 81.23,47.04 79.38,48.9 79.38,56.52 78.11,57.78 54.61,57.78 52.78,55.95 IC1.120
DQ14
  Top 0.254: U$26.48 80.9,48.64 80.01,49.53 80.01,57.15 78.74,58.42 53.98,58.42 52.28,56.73 IC1.121
DQ15
  Top 0.254: U$26.49 81.03,49.44 80.67,49.8 80.67,51.41 80.64,51.44 80.64,57.78 79.38,59.05 52.7,59.05 50.28,56.63 IC1.125
FPGA_CLK  (via drill 0.3, 0.5)
  Top 0.254: IC1.24 34.08,37.89 v33.66,37.47
  Top 0.406: R27.2 v25.4,30.48
  Inner15 0.406: v33.66,37.47 32.38,37.47 v25.4,30.48
GND  (via drill 0.3, 0.5)
  Top 0.254: J2.2 101.41,90.93 | 101.41,90.93 J2.MH3 | J2.17 108.91,90.43 109.28,90.81 | 109.28,90.81 J2.MH4 | J2.5 102.91,89.43 101.57,90.77 | 101.57,90.77 101.41,90.93 | J2.8 104.41,90.53 104.14,90.81 101.6,90.81 101.57,90.77 | J2.11 105.91,90.67 106.05,90.81 109.28,90.81 | 21.59,67.31 21.59,66.67 21.73,66.54 IC2.3 24.27,66.54 IC2.EXP 25.77,67.04 IC2.23 | 21.59,67.31 21.59,67.94 | 21.59,67.94 21.59,68.58 | 21.59,68.58 22.23,69.22 23.5,69.22 23.77,68.94 IC2.27 | IC2.2 21.86,67.04 21.59,67.31 | IC2.1 22,67.54 21.59,67.94 | IC2.M 22.03,68.14 21.59,68.58 | IC1.140 42.78,52.94 v43.18,53.34 | IC1.2 37.02,48.89 v36.83,48.7 | IC1.4 40.41,47.89 v40.7,47.6 | IC1.36 38.79,30.54 v38.73,30.48 | IC1.41 42.78,28.38 | IC1.48 46.28,30.89 v47.05,31.66 | IC1.63 53.78,31.18 v54.26,31.66 | IC1.57 50.78,32.23 | IC1.118 53.78,53.08 v54.2,53.5 | IC1.123 51.28,53.48 v51.3,53.5 | IC1.131 47.28,50.08 v46.9,49.7 | IC1.97 58.49,43.89 v58.42,43.81 | IC1.108 62.09,49.39 v62.87,50.16 | IC1.95 61.94,42.89 v62.23,43.18 61.44,42.39 IC1.94 | IC1.27 40.57,36.39 v40.93,36.03 | IC1.19 v41.09,40.39 v41.1,40.4 | IC1.22 40.35,38.89 v40.45,38.8 | IC1.74 61.41,32.39 v62.2,31.6 | IC1.82 58.23,36.39 56.52,38.1 v56.52,40.01 56.9,40.39 58.42,40.39 | IC1.79 62.2,34.89 v62.23,34.92 | IC1.90 58.42,40.39 | IC1.91 58.92,40.89 58.42,40.39
  Top 0.305: IC3.14 81.67,67.56 81.28,67.94 81.28,70.81 | IC3.6 81.28,70.81 | 81.28,70.81 IC3.19 | U$16.4 18.2,41.7 v17.14,40.64 | U$1.4 v15.88,48.9 | 42.78,28.38 v42.5,28.1 | 50.78,32.23 v50.47,32.55 | JTAG.2 3.81,14.61 4.45,13.97 10.16,13.97 13.02,16.82 R28.1 C58.2
  Top 0.406: U$26.41 84.03,43.04 v84.07,43 85.58,43 C51.2 | U$26.47 84.03,47.84 v84.07,47.8 85.58,47.8 C52.2 | U$26.26 83.43,31.04 v83.67,30.8 84.45,31.59 C55.2 | 81.28,70.81 81.28,72.39 v80.64,73.03 | U$14.2 112.86,64.94 114.3,63.5 117,63.5 PS2.3 | v97.79,58.42 R14.1 | v97.79,64.77 R15.1 | U$26.50 83.61,50.24 v83.77,50.4 | U$26.4 72.17,47.84 v72.39,47.62 73.97,49.21 C54.2 | U$26.10 72.25,43.04 v72.39,43.18 | C53.2 v69.22,29.21 | AUDIO_OUT.SLEEVE 121.92,86.67 R5.1 | JOYPAD2.3 118.97,41.5 116.84,39.37 112.25,39.37 U$20.2 | JOYPAD1.3 118.97,23.09 116.84,20.95 116.06,20.95 U$18.2 | R43.1 v97.79,37.47 | R41.1 v97.79,22.86 | U$21.2 112.86,33.83 v113.03,33.66 | U$19.2 111.44,18.73 v112.39,17.78 | U$13.2 112.08,54.3 v112.39,53.98 112.39,53.02 C30.2 | JOYPAD1.S1 117.14,7.94 C29.2 109.86,7.94 | 109.86,7.94 101.6,7.94 | 101.6,7.94 92.71,7.94 | 92.71,7.94 87.77,7.94 BUTTON_3.3 | BUTTON_2.3 92.42,7.65 92.71,7.94 | BUTTON_1.3 100.67,7.01 101.6,7.94 | BUTTON_0.3 108.93,7.01 109.86,7.94 | v20.95,69.22 21.59,68.58 | POWER.C v36.2,70.48 | R31.2 v12.06,55.88 | C57.2 v20.32,10.79 17.78,10.79 | 17.78,10.79 17.78,13.15 S1.4 | 17.78,10.79 17.78,4.63 S1.3 | C35.2 v69.22,6.35 | C37.2 v97.79,50.8 | SV1.3 32.38,14.92 C36.2 | J1.2 10.44,89.14 10.5,89.2
  Top 0.61: C4.2 28.57,83.19 v29.21,82.55 | C5.2 40.95,80.97 43.18,78.74 v43.18,78.11 | C7.2 64.45,89.22 64.77,88.9 v64.77,87.63 | C8.2 v81.28,90.17 81.28,87.63 | 81.28,87.63 C9.2 | 81.28,87.63 83.82,87.63 | C6.2 98.11,91.12 98.42,91.44 | C12.2 v17.14,57.78 | C14.2 v19.68,57.15 | C13.2 v28.57,59.05 | C56.2 15.24,26.04 v15.88,25.4 U$12.2
  Top 1.27: U$7.1 53.06,85.37 50.16,88.27 v48.26,88.27 | U$8.1 73.89,82.59 C10.- | 10.5,89.1 10.5,83.3 12.5,81.3 29.4,81.3 | 22.9,94 17.1,94 15.2,92.1 13.4,92.1 10.5,89.2 10.4,89.1 | U$9.1 84.15,82.61 C11.- | v45.09,40.64 IC1.145 | IC1.145 v49.53,44.45 | v53.98,40.64 IC1.145 | v49.53,36.83 IC1.145
  Bottom 0.254: v47.05,31.66 47.05,31.7 C42.2
  Bottom 0.406: v36.83,55.24 C59.2 | C62.2 v56.52,41.91 | C60.2 v42.55,39.37 | C31.2 46.99,40.64 | 46.99,40.64 C32.2 | v45.09,40.64 46.99,40.64 | C34.2 52.07,40.64 | 52.07,40.64 C33.2 | v53.98,40.64 52.07,40.64 | C50.2 v62.87,50.16 | C49.2 v39.37,55.24 | v38.73,30.48 37.78,29.53 C48.2 37.7,28.66 C41.2 | v54.26,31.66 54.26,33.06 C61.2 | v62.2,31.6 62.2,30.14 C47.2 | C40.2 v49.53,44.45 | v41.1,40.4 41.1,41.6 C39.2 | C46.2 42.66,27.94 v42.5,28.1 | C45.2 36.95,48.57 v36.83,48.7 | C38.2 42.07,53.34 v43.18,53.34 | C44.2 61.74,59.86 v60.42,59.86 | C43.2 62.55,42.87 v62.23,43.18
  other vias: 43.18,88.27 44.45,88.27 45.72,88.27 46.99,88.27 66.04,87.63 67.31,87.63 68.58,87.63 69.85,87.63 84.45,80.01 81.92,82.55 81.92,81.28 81.92,80.01 83.19,80.01 71.12,82.55 71.12,81.28 71.12,80.01 72.39,80.01 73.66,80.01 29.21,81.28 29.21,80.01 29.21,78.74 30.48,78.11 44.45,78.11 45.72,78.11 46.99,78.11 48.26,78.11
  pour Inner2: 1.27,98.42 126.36,98.42 126.36,1.27 1.27,1.27
  pour Top (isolate 0.254): 95.25,98.42 95.25,85.09 115.57,85.09 115.57,98.42
  pour Top (isolate 0.254): 42.55,87.93 42.55,92.08 48.9,92.08 48.9,87.93
  pour Top (isolate 0.254): 64.14,87.63 64.14,91.44 70.48,91.44 70.48,87.63 69.85,87 64.77,87
  pour Top (isolate 0.254): 71.12,83.19 74.3,83.19 74.93,82.55 74.93,80.01 74.3,79.38 71.12,79.38 70.48,80.01 70.48,82.55
  pour Top (isolate 0.254): 42.55,78.11 42.55,80.64 43.18,81.28 43.81,81.92 47.62,81.92 48.9,80.64 48.9,77.47 42.55,77.47
  pour Top (isolate 0.254): 29.21,83.19 28.57,82.55 28.57,78.74 30.48,76.83 32.38,76.83 32.38,83.19
  pour Top (isolate 0.254): 84.45,79.38 81.92,79.38 81.28,80.01 81.28,82.55 81.92,83.19 84.45,83.19 85.09,82.55 85.09,80.01
HDMI_5V  (via drill 0.3, 0.5)
  Top 0.254: J2.18 109.41,84.71 v109.2,84.5 | IC3.13 85.21,66.91 v85.3,67
  Bottom 0.813: v85.3,67 v86.5,67 v87.7,67 94.4,67 v109.2,81.8 | 109.22,81.78 v109.2,81.8 | v109.2,81.8 v109.2,82.7 v109.2,83.6 v109.2,84.5
HDMI_BN
  Top 0.254: 55.24,69.85 44.78,59.38 IC1.136
  Top 0.305: R7.1 55.24,69.85
HDMI_BP
  Top 0.254: 55.88,71.75 44.28,60.16 IC1.137
  Top 0.305: R4.1 63.5,69.85 61.59,71.75 55.88,71.75
HDMI_CLKN  (via drill 0.3)
  Top 0.254: J2.12 106.41,82.28 97.81,73.69 | 97.81,73.69 92.34,68.21 IC3.15 | v97.8,73.7 97.81,73.69
  Top 0.305: R19.2 61.59,66.04 v62.23,65.41
  Inner15 0.305: v62.23,65.41 64.14,63.5 87.6,63.5 v97.8,73.7
HDMI_CLKP  (via drill 0.3)
  Top 0.254: J2.10 105.41,82.55 96.53,73.67 | 96.53,73.67 91.72,68.86 IC3.16 | v96.5,73.7 96.53,73.67
  Top 0.305: R18.2 67.94,66.04 v68.58,65.41
  Inner15 0.305: v68.58,65.41 88.2,65.41 v96.5,73.7
HDMI_CN
  Top 0.254: IC1.134 45.78,57.84 53.98,66.04
  Top 0.305: 53.98,66.04 R19.1
HDMI_CP
  Top 0.254: 54.61,67.94 45.28,58.62 IC1.135
  Top 0.305: R18.1 63.5,66.04 61.59,67.94 54.61,67.94
HDMI_D0N  (via drill 0.3)
  Top 0.254: J2.9 104.91,83.32 v95.3,73.7 | v95.3,73.7 91.1,69.51 IC3.17 | v95.3,73.7
  Top 0.305: R7.2 61.59,69.85 v62.23,69.22
  Inner15 0.305: v62.23,69.22 63.5,67.94 89.55,67.94 v95.3,73.7
HDMI_D0P  (via drill 0.3)
  Top 0.254: J2.7 103.91,83.59 v94.01,73.69 | v94.01,73.69 90.48,70.16 IC3.18 | v94,73.7 v94.01,73.69
  Top 0.305: R4.2 67.94,69.85 v68.58,69.22
  Inner15 0.305: v68.58,69.22 89.52,69.22 v94,73.7
HDMI_D1N  (via drill 0.3)
  Top 0.254: J2.6 103.41,84.36 92.78,73.72 | 92.78,73.72 90.51,71.46 IC3.20 | v92.8,73.7 92.78,73.72
  Top 0.305: R9.2 61.59,73.66 v62.23,73.03
  Inner15 0.305: v62.23,73.03 63.5,71.75 67.94,71.75 69.85,69.85 88.95,69.85 v92.8,73.7
HDMI_D1P  (via drill 0.3)
  Top 0.254: J2.4 102.41,84.63 v91.49,73.71 | v91.49,73.71 89.89,72.11 IC3.21 | v91.5,73.7 v91.49,73.71
  Top 0.305: R8.2 67.94,73.66 v68.58,73.03
  Inner15 0.305: v68.58,73.03 71.12,70.48 88.28,70.48 v91.5,73.7
HDMI_D2N  (via drill 0.3)
  Top 0.254: IC3.22 89.26,72.76 v90.2,73.7 101.91,85.41 J2.3
  Top 0.305: R17.2 61.59,77.47 v62.23,76.83
  Inner15 0.305: v62.23,76.83 63.5,75.56 67.94,75.56 72.39,71.12 87.62,71.12 v90.2,73.7
HDMI_D2P  (via drill 0.3)
  Top 0.254: J2.1 100.91,85.67 88.92,73.68 | 88.92,73.68 88.65,73.41 IC3.23 | v88.9,73.7 88.92,73.68
  Top 0.305: R16.2 67.94,77.47 v68.58,76.83
  Inner15 0.305: v68.58,76.83 73.66,71.75 86.95,71.75 v88.9,73.7
HDMI_GN
  Top 0.254: 55.24,73.66 42.28,60.7 IC1.141
  Top 0.305: R9.1 55.24,73.66
HDMI_GP
  Top 0.254: 55.88,75.56 41.78,61.47 IC1.142
  Top 0.305: R8.1 63.5,73.66 61.59,75.56 55.88,75.56
HDMI_RN
  Top 0.254: IC1.143 41.28,62.23 56.52,77.47
  Top 0.305: 56.52,77.47 R17.1
HDMI_RP
  Top 0.254: 57.15,79.38 40.78,63.01 IC1.144
  Top 0.305: R16.1 64.14,77.47 62.23,79.38 57.15,79.38
HPD_B
  Top 0.254: IC3.10 78.16,68.21 78.67,67.7 78.67,65.4 79.86,64.2 94.05,64.2 110.2,80.36 110.2,85.9 109.91,86.19 J2.19
JP1_CLK
  Top 0.406: R35.2 110.32,27.94 U$18.3 111.95,27.77 JOYPAD1.5
JP1_CLK_Q
  Top 0.254: R39.1 96.52,25.4 95.25,24.13 95.25,20.32 93.98,19.05 47.62,19.05 46.78,19.89 IC1.49
JP1_DATA
  Top 0.406: JOYPAD1.1 118.78,20.98 117.47,19.68 114.94,19.68 111.12,23.5 107.63,23.5 R40.2
JP1_DATA_D  (via drill 0.3)
  Top 0.254: IC1.88 65.42,39.39 v66.04,40.01
  Top 0.406: R40.1 v102.87,22.86 R41.2
  Inner15 0.61: v66.04,40.01 67.31,38.73 87,38.73 v102.87,22.86
JP1_LATCH
  Top 0.406: JOYPAD1.6 111.5,21.42 U$19.3 110.32,21.59 109.22,21.59 107.95,20.32 R34.2
JP1_LATCH_Q
  Top 0.254: R38.1 103.5,17.78 102.87,18.41 46.99,18.41 45.28,20.12 IC1.46
JP2_CLK
  Top 0.406: JOYPAD2.5 115.76,42.38 U$20.3 110.32,42.55 R33.2
JP2_CLK_Q
  Top 0.254: R37.1 95.25,40.01 93.98,38.73 93.98,21.59 92.71,20.32 48.9,20.32 47.78,21.43 IC1.51
JP2_DATA
  Top 0.406: R42.2 107.31,37.47 107.95,38.1 117.83,38.1 JOYPAD2.1
JP2_DATA_D  (via drill 0.3)
  Top 0.254: IC1.89 63.38,39.89 v64.44,40.94
  Top 0.406: R42.1 v102.87,37.47 R43.2
  Inner15 0.61: v64.44,40.94 65.41,41.91 98.42,41.91 v102.87,37.47
JP2_LATCH
  Top 0.406: R32.2 107.95,34.92 109.22,36.2 110.32,36.2 U$21.3 115.31,36.02 JOYPAD2.6
JP2_LATCH_Q
  Top 0.254: R36.1 96.52,32.38 94.61,30.48 94.61,20.95 93.34,19.68 48.26,19.68 47.28,20.66 IC1.50
LDQM
  Top 0.254: 70.56,39.8 U$26.14 70.54,39.9 67.87,39.9 63.38,44.39 IC1.98
N$4
  Top 0.254: IC2.9 23.77,62.27 R1.2
N$7
  Top 0.254: IC2.6 21.23,65.04 19.68,63.5 C14.1 | 22.41,61.73 R1.1
  Top 0.61: C12.1 19.23,61.27 C14.1 22.41,61.73
N$8
  Top 0.406: R2.2 110,55.88 U$13.1
N$9
  Top 0.406: R3.2 110,64.77 U$14.1
N$14
  Top 0.406: AUDIO_OUT.TIP 116.92,84.22 R5.2 | AUDIO_OUT.TIP 112.82,83.11 C21.1 | AUDIO_OUT.TIP 118.19,83.11 118.75,82.55 118.75,73.66 118.11,73.03 117,73.03 AUDIO_OUT.RING
N$17
  Top 0.406: C21.2 R6.2
N$29  (via drill 0.3)
  Top 0.254: IC1.37 40.78,32.52 v42.55,34.29
  Bottom 0.406: U$23.2 43.18,33.66 v42.55,34.29 C60.1
N$31  (via drill 0.5)
  Top 0.254: v36.83,50.16 37.6,49.39 IC1.1 42.1,49.39 v42.31,49.4
  Bottom 0.406: C59.1 v36.83,50.16 | U$22.2 v42.31,49.4
N$36  (via drill 0.3)
  Top 0.254: IC1.109 58.28,50.02 56.52,48.26 v56.52,46.99
  Bottom 0.406: U$25.1 55.88,47.62 v56.52,46.99 C62.1
N$37
  Top 0.305: U$16.2 R26.2
N$38
  Top 0.406: U$12.3 24.77,25.4 25.4,26.04 R27.1
N$42
  Top 0.406: R39.2 109.37,25.4 U$18.1
N$43
  Top 0.406: R38.2 108.1,17.78 U$19.1
N$44
  Top 0.406: R37.2 109.37,40.01 U$20.1
N$45
  Top 0.406: R36.2 108.1,32.38 U$21.1
N$46
  Top 0.406: R56.2 POWER.A
N$47  (via drill 0.3)
  Top 0.254: IC1.73 59.21,31.89 57.8,33.3 v57,33.3
  Bottom 0.406: C61.1 55.91,33.3 v57,33.3 57.15,33.45 U$24.1
N$93
  Top 0.254: IC1.9 27.64,45.39 26.67,46.35 26.67,52.7 24.77,54.61 R57.2
PMOD_0
  Top 0.254: IC1.44 44.28,24.59
  Top 0.305: SV1.11 42.55,22.86 44.28,24.59
PMOD_1
  Top 0.254: IC1.42 43.28,26.77
  Top 0.305: SV1.9 40.01,23.5 43.28,26.77
PMOD_2
  Top 0.254: IC1.33 36.56,33.39 35.56,32.38
  Top 0.305: SV1.7 37.47,13.97 35.56,15.88 35.56,32.38
PMOD_3
  Top 0.254: IC1.31 36.3,34.39 34.29,32.38
  Top 0.305: SV1.5 34.92,13.34 34.29,13.97 34.29,32.38
PMOD_4
  Top 0.254: IC1.43 43.78,25.36
  Top 0.305: SV1.12 41.27,10.16 41.27,22.86 43.78,25.36
PMOD_5
  Top 0.254: 38.73,25.4 41.78,28.45 IC1.39
  Top 0.305: SV1.10 38.73,10.16 38.73,25.4
PMOD_6
  Top 0.254: IC1.32 36.43,33.89 34.92,32.38
  Top 0.305: SV1.8 36.2,10.16 36.2,13.97 34.92,15.24 34.92,32.38
PMOD_7
  Top 0.254: IC1.30 35.52,34.89 33.66,33.02
  Top 0.305: SV1.6 34.29,8.89 33.66,9.53 33.66,33.02
PS2_CLK
  Top 0.406: 110.65,69.37 111.12,68.89 U$14.3 115.12,67.14 PS2.5 | 110.65,69.37 R11.2 | R13.2 108.58,67.31 110.65,69.37
PS2_CLK_D  (via drill 0.3)
  Top 0.254: v102.87,66.04 102.71,66.2 | IC1.127 49.28,54.23 48.26,55.24 48.26,56.52 v49.53,57.78
  Top 0.406: R13.1 103.82,67.31 102.71,66.2 R15.2
  Inner15 0.305: v102.87,66.04 102.87,64.14 100.33,61.59 53.34,61.59 v49.53,57.78
PS2_CLK_Q
  Top 0.254: R3.1 104.78,64.77 103.5,63.5 52.7,63.5 46.28,57.08 IC1.133
PS2_DATA
  Top 0.406: 110.65,60.48 111.12,60.01 U$13.3 111.3,58.42 113.67,58.42 118.78,63.53 PS2.1 | 110.65,60.48 R10.2 | R12.2 108.58,58.42 110.65,60.48
PS2_DATA_D  (via drill 0.3)
  Top 0.254: IC1.126 49.78,55.3 v49.2,55.88
  Top 0.406: R12.1 v102.87,58.42 R14.2
  Inner15 0.305: v102.87,58.42 100.49,60.8 54.12,60.8 v49.2,55.88
PS2_DATA_Q
  Top 0.254: R2.1 97.16,55.88 95.25,57.78 95.25,61.59 93.98,62.87 53.34,62.87 46.78,56.3 IC1.132
RESET  (via drill 0.3, 0.5)
  Top 0.254: IC1.25 35.78,37.39 v35.23,36.83
  Top 0.406: S1.2 12.99,15.53 13.34,15.88 19.68,15.88 20.32,15.24 C57.1 R44.1 v22.86,15.88
  Inner15 0.406: v35.23,36.83 34.92,36.83 27.3,29.21 27.3,20.32 v22.86,15.88
RW
  Top 0.254: 70.56,39 U$26.15 70.54,39.1 69.77,39.1 69.56,38.89 IC1.87
SCL_B
  Top 0.254: J2.15 107.91,80.61 92.81,65.5 80.67,65.5 79.97,66.2 79.97,68.8 79.25,69.51 IC3.8
SDA_B
  Top 0.254: J2.16 108.41,79.83 93.47,64.9 80.27,64.9 79.27,65.9 79.27,68.4 78.81,68.86 IC3.9
SDRAM_CLK
  Top 0.254: U$26.35 77.61,38.24 76.2,36.83 76.2,29.21 74.93,27.94 58.42,27.94 57.78,28.58 IC1.71
TCK  (via drill 0.5)
  Top 0.254: v7.62,34.92 10.29,37.6 28.7,37.6 32.99,41.89 IC1.16
  Top 0.305: JTAG.1 8.26,15.24 10.16,17.14 R28.2
  Inner15 0.254: JTAG.1 5.08,16.51 5.08,32.38 v7.62,34.92
TDI  (via drill 0.5)
  Top 0.254: JTAG.9 6.3,25.45 6.3,35 9.4,38.1 28.3,38.1 32.59,42.39 IC1.15
  Top 0.406: R30.2 v10.79,27.94
  Inner15 0.406: JTAG.9 8.26,25.4 v10.79,27.94
TDO
  Top 0.254: IC1.20 32.69,39.89 29.2,36.4 12.6,36.4 8.9,32.7 8.9,19.3 7.4,17.8 6.37,17.8 JTAG.3
TMS  (via drill 0.5)
  Top 0.254: IC1.18 32.79,40.89 28.9,37 12.3,37 8.3,33 8.3,21.6 7,20.3 6.37,20.3 JTAG.5
  Top 0.406: R29.2 v14.61,22.23
  Inner15 0.406: v14.61,22.23 14.61,20.95 13.97,20.32 JTAG.5
UDQM
  Top 0.254: U$26.36 80.97,39.04 75.56,44.45 75.56,52.7 74.3,53.98 57.78,53.98 57.28,53.47 IC1.111
USB_DN
  Top 0.254: IC2.5 21.45,65.54 17.14,69.85 15.53,69.85 X1.2
USB_DP
  Top 0.254: X1.3 12.87,70.02 13.34,70.48 17.14,70.48 21.59,66.04 IC2.4
VBUS  (via drill 0.3, 0.5)
  Top 0.254: IC2.7 22.46,63.77 v22.4,63.7 22.44,63.74 IC2.8
  Top 0.61: C13.1 v22.23,59.05
  Top 1.016: D2.A v31.11,74.3
  Inner15 0.61: v22.4,63.7 22.4,59.23 v22.23,59.05
  Inner15 1.016: v22.4,63.7 19.41,66.69 X1.1 22.47,74.3 v31.11,74.3 v32.38,74.3 v33.66,74.3
VHIGH
  Top 0.61: C4.1 25.09,85.31 D1.C
  Top 1.27: U$6.P$2 26.13,93.23 D1.C 34.29,86.36 36.83,83.82 U$5.3
VIN
  Top 1.27: J1.3 21.87,86.1 D1.A
~CAS
  Top 0.254: 70.56,38.2 U$26.16 70.46,38.1 69.85,38.1 69.56,38.39 IC1.86
~CE  (via drill 0.5)
  Top 0.254: AS.6 5.08,41.91 9.53,41.91 v10.79,40.64 | IC1.21 33.04,39.39 29.21,35.56 13.34,35.56 v10.79,33.02
  Top 0.406: R31.1 v12.06,50.8
  Inner15 0.406: v10.79,33.02 v10.79,40.64 12.06,41.91 v12.06,50.8
~CONFIG  (via drill 0.5)
  Top 0.254: AS.5 8.89,43.18 | IC1.14 32.09,42.89 27.94,38.73
  Top 0.305: 27.94,38.73 14.61,38.73 10.16,43.18 8.89,43.18
  Top 0.406: R58.2 v8.89,55.24
  Inner15 0.406: v8.89,55.24 10.16,53.98 10.16,46.99 AS.5
~CS  (via drill 0.3, 0.5)
  Top 0.254: 70.56,36.6 U$26.18 | IC1.59 v51.78,31.69 v51.77,31.7
  Top 0.406: U$26.18 72.27,36.64 v72.27,36.6
  Inner15 0.305: v72.27,36.6 56.67,36.6 v51.77,31.7
~CSO  (via drill 0.3)
  Top 0.254: IC1.8 32.85,45.89
  Top 0.305: AS.8 5.08,46.99 9.53,46.99 10.79,45.72 U$16.1 19.58,45.72 20,45.3 20,41 20.4,40.6 27.6,40.6 28,41 28,42.48 v27.94,42.55 | 32.85,45.89 28.41,45.89 v27.94,46.35
  Inner15 0.305: v27.94,42.55 v27.94,46.35
~RAS
  Top 0.254: IC1.85 69.28,37.89 69.7,37.47 70.58,37.47 U$26.17